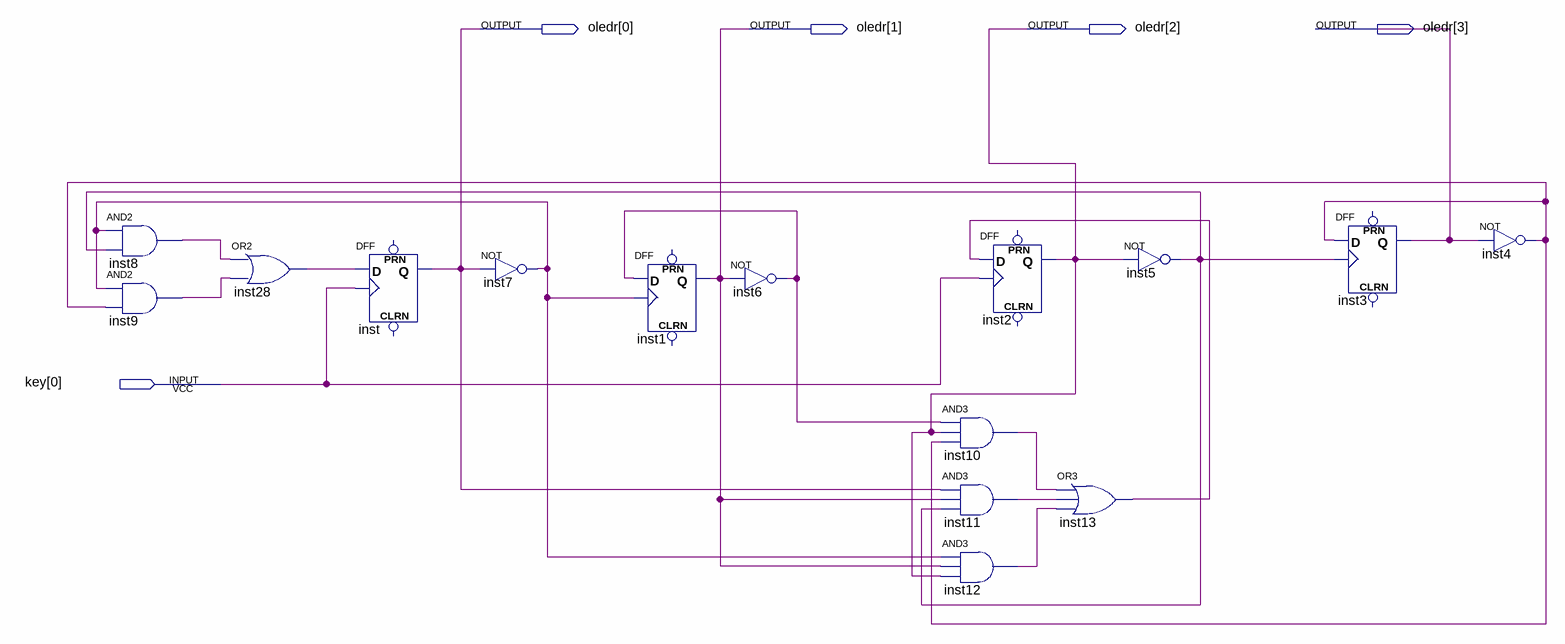
[diagram p0: schematic sheet]
// Quartus schematic lab2-async.bdf as structural Verilog: 15 symbols, 5 pins
module \lab2-async  (
  input  [0:0] key,
  output [3:0] oledr
);

  wire inst4_out, inst5_out, inst6_out, inst7_out, inst8_out, inst9_out, inst10_out, inst11_out, inst12_out,
       inst13_out, inst28_out;

  and inst8 (inst8_out, inst7_out, inst5_out);
  and inst9 (inst9_out, inst7_out, inst4_out);
  or inst28 (inst28_out, inst8_out, inst9_out);
  DFF inst (.CLK(key[0]), .D(inst28_out), .Q(oledr[0]));  // open: CLRN, PRN
  not inst7 (inst7_out, oledr[0]);
  DFF inst1 (.CLK(inst7_out), .D(inst6_out), .Q(oledr[1]));  // open: CLRN, PRN
  not inst6 (inst6_out, oledr[1]);
  and inst10 (inst10_out, inst6_out, oledr[2], inst4_out);
  and inst11 (inst11_out, oledr[0], oledr[1], inst5_out);
  and inst12 (inst12_out, inst7_out, oledr[1], oledr[2]);
  DFF inst2 (.CLK(key[0]), .D(inst13_out), .Q(oledr[2]));  // open: CLRN, PRN
  or inst13 (inst13_out, inst10_out, inst11_out, inst12_out);
  not inst5 (inst5_out, oledr[2]);
  DFF inst3 (.CLK(inst5_out), .D(inst4_out), .Q(oledr[3]));  // open: CLRN, PRN
  not inst4 (inst4_out, oledr[3]);
endmodule
